# Altium project modbus_rs485_demo.PrjPcb
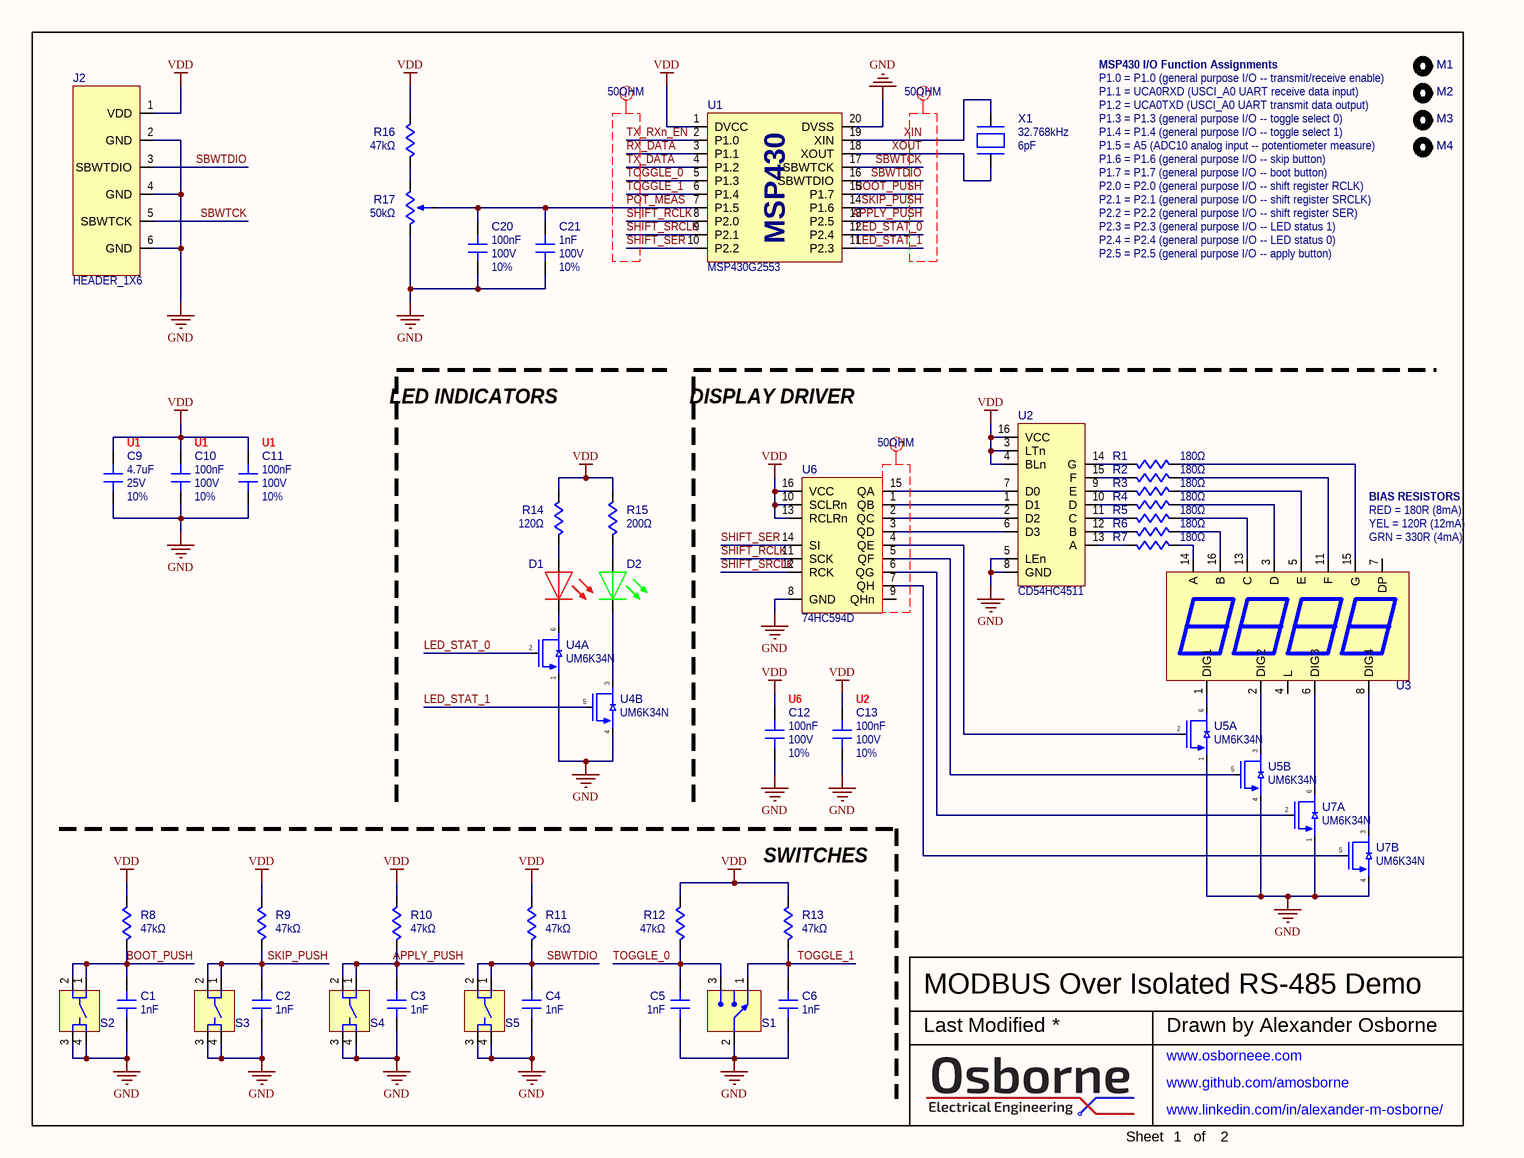
[diagram p0: schematic.SchDoc]
2 sheets, 74 parts. Net scope: global (net labels, ports and power ports of the same name join across sheets).
Board file: pcb.PcbDoc
Sheets:
  schematic.SchDoc
  rs485_interface.SchDoc

## Sheet schematic.SchDoc: MODBUS Over Isolated RS-485 Demo
size Letter; Organization: ORGANIZATION; Address1: ADDRESS 1; Address2: ADDRESS 2; Address3: ADDRESS 3; Address4: ADDRESS 4; DocumentNumber: 1; Revision: -; SheetNumber: 1; SheetTotal: 2; ENG_APP_DATE: --/--/--; DSN_APP_DATE: --/--/--; CHK_APP_DATE: --/--/--

### Parts
C1  value 1nF  [C0805]  (hidden comment: CAP-CER-1N00-10T-100V-0805)
C2  value 1nF  [C0805]  (hidden comment: CAP-CER-1N00-10T-100V-0805)
C3  value 1nF  [C0805]  (hidden comment: CAP-CER-1N00-10T-100V-0805)
C4  value 1nF  [C0805]  (hidden comment: CAP-CER-1N00-10T-100V-0805)
C5  value 1nF  [C0805]  (hidden comment: CAP-CER-1N00-10T-100V-0805)
C6  value 1nF  [C0805]  (hidden comment: CAP-CER-1N00-10T-100V-0805)
C9  value 4.7uF  Voltage: 25V  Tolerance: 10%  [C0805]  (hidden comment: CAP-CER-4U70-10T-25V-0805)
C10  value 100nF  Voltage: 100V  Tolerance: 10%  [C0805]  (hidden comment: CAP-CER-100N-10T-100V-0805)
C11  value 100nF  Voltage: 100V  Tolerance: 10%  [C0805]  (hidden comment: CAP-CER-100N-10T-100V-0805)
C12  value 100nF  Voltage: 100V  Tolerance: 10%  [C0805]  (hidden comment: CAP-CER-100N-10T-100V-0805)
C13  value 100nF  Voltage: 100V  Tolerance: 10%  [C0805]  (hidden comment: CAP-CER-100N-10T-100V-0805)
C20  value 100nF  Voltage: 100V  Tolerance: 10%  [C0805]  (hidden comment: CAP-CER-100N-10T-100V-0805)
C21  value 1nF  Voltage: 100V  Tolerance: 10%  [C0805]  (hidden comment: CAP-CER-1N00-10T-100V-0805)
D1  LED_RED  [D0805]  (value not drawn)
D2  LED_GREEN  [D0805]  (value not drawn)
J2  HEADER_1X6  [Header_1x6]
M1  MTG_HOLE  [MTG_HOLE_No4]  (value not drawn)  (no BOM)
M2  MTG_HOLE  [MTG_HOLE_No4]  (value not drawn)  (no BOM)
M3  MTG_HOLE  [MTG_HOLE_No4]  (value not drawn)  (no BOM)
M4  MTG_HOLE  [MTG_HOLE_No4]  (value not drawn)  (no BOM)
R1  value 180Ω  [R0805]  (hidden comment: RES-180R-1T00-W125-0805)
R2  value 180Ω  [R0805]  (hidden comment: RES-180R-1T00-W125-0805)
R3  value 180Ω  [R0805]  (hidden comment: RES-180R-1T00-W125-0805)
R4  value 180Ω  [R0805]  (hidden comment: RES-180R-1T00-W125-0805)
R5  value 180Ω  [R0805]  (hidden comment: RES-180R-1T00-W125-0805)
R6  value 180Ω  [R0805]  (hidden comment: RES-180R-1T00-W125-0805)
R7  value 180Ω  [R0805]  (hidden comment: RES-180R-1T00-W125-0805)
R8  value 47kΩ  [R0805]  (hidden comment: RES-47K0-1T00-W125-0805)
R9  value 47kΩ  [R0805]  (hidden comment: RES-47K0-1T00-W125-0805)
R10  value 47kΩ  [R0805]  (hidden comment: RES-47K0-1T00-W125-0805)
R11  value 47kΩ  [R0805]  (hidden comment: RES-47K0-1T00-W125-0805)
R12  value 47kΩ  [R0805]  (hidden comment: RES-47K0-1T00-W125-0805)
R13  value 47kΩ  [R0805]  (hidden comment: RES-47K0-1T00-W125-0805)
R14  value 120Ω  [R0805]  (hidden comment: RES-120R-1T00-W125-0805)
R15  value 200Ω  [R0805]  (hidden comment: RES-200R-1T00-W125-0805)
R16  value 47kΩ  [R0805]  (hidden comment: RES-47K0-1T00-W125-0805)
R17  value 50kΩ  [3352T_Trimpot]  (hidden comment: RES-50K0-TRIMMER)
S1  SPDT-TOGGLE-SWITCH  [AST13SNCQ]  (value not drawn)
S2  PTS647  [PTS647]  (value not drawn)
S3  PTS647  [PTS647]  (value not drawn)
S4  PTS647  [PTS647]  (value not drawn)
S5  PTS647  [PTS647]  (value not drawn)
U1  MSP430G2553  [MSP430G2553_TSSOP-20]
U2  CD54HC4511  [CD54HC4511_SOIC-16]
U3  QUAD-7SEG-DISP  [LTC-4727]  (value not drawn)
U4  UM6K34N  [UM6K34N_SC-88]  (parts A,B of 2)
U5  UM6K34N  [UM6K34N_SC-88]  (parts A,B of 2)
U6  74HC594D  [74HC594D_SOIC-16]
U7  UM6K34N  [UM6K34N_SC-88]  (parts A,B of 2)
X1  Capacitance: 6pF  Frequency: 32.768kHz  [CRYSTAL_THT_2x6]  (hidden comment: 830014219B)

### Nets
GND: C1.2 C2.2 C3.2 C4.2 C5.2 C6.2 C9.2 C10.2 C11.2 C12.2 C13.2 C20.2 C21.2 J2.2(GND) J2.4(GND) J2.6(GND) R17.3 S1.2 S2.3 S2.4 S3.3 S3.4 S4.3 S4.4 S5.3 S5.4 U1.20(DVSS) U2.5(LEn) U2.8(GND) U4.1(S1) U4.4(S2) U5.1(S1) U5.4(S2) U6.8(GND) U7.1(S1) U7.4(S2)
VDD: C9.1 C10.1 C11.1 C12.1 C13.1 J2.1(VDD) R8.1 R9.1 R10.1 R11.1 R12.1 R13.1 R14.1 R15.1 R16.1 U1.1(DVCC) U2.3(LTn) U2.4(BLn) U2.16(VCC) U6.10(SCLRn) U6.13(RCLRn) U6.16(VCC)
APPLY_PUSH: C3.1 R10.2 S4.1 S4.2 U1.13(P2.5)
BOOT_PUSH: C1.1 R8.2 S2.1 S2.2 U1.15(P1.7)
LED_STAT_0: U1.12(P2.4) U4.2(G1)
LED_STAT_1: U1.11(P2.3) U4.5(G2)
POT_MEAS: C20.1 C21.1 R17.2 U1.7(P1.5)
RX_DATA: U1.3(P1.1)
SBWTCK: J2.5(SBWTCK) U1.17(SBWTCK)
SBWTDIO: C4.1 J2.3(SBWTDIO) R11.2 S5.1 S5.2 U1.16(SBWTDIO)
SHIFT_RCLK: U1.8(P2.0) U6.11(SCK)
SHIFT_SER: U1.10(P2.2) U6.14(SI)
SHIFT_SRCLK: U1.9(P2.1) U6.12(RCK)
SKIP_PUSH: C2.1 R9.2 S3.1 S3.2 U1.14(P1.6)
TOGGLE_0: C5.1 R12.2 S1.3 U1.5(P1.3)
TOGGLE_1: C6.1 R13.2 S1.1 U1.6(P1.4)
TX_DATA: U1.4(P1.2)
TX_RXn_EN: U1.2(P1.0)
XIN: U1.19(XIN) X1.1
XOUT: U1.18(XOUT) X1.2
NetD1_1: D1.1 U4.6(D1)
NetD1_2: D1.2 R14.2
NetD2_1: D2.1 U4.3(D2)
NetD2_2: D2.2 R15.2
NetR1_1: R1.1 U2.14(G)
NetR1_2: R1.2 U3.15(G)
NetR2_1: R2.1 U2.15(F)
NetR2_2: R2.2 U3.11(F)
NetR3_1: R3.1 U2.9(E)
NetR3_2: R3.2 U3.5(E)
NetR4_1: R4.1 U2.10(D)
NetR4_2: R4.2 U3.3(D)
NetR5_1: R5.1 U2.11(C)
NetR5_2: R5.2 U3.13(C)
NetR6_1: R6.1 U2.12(B)
NetR6_2: R6.2 U3.16(B)
NetR7_1: R7.1 U2.13(A)
NetR7_2: R7.2 U3.14(A)
NetR16_2: R16.2 R17.1
NetU2_1: U2.1(D1) U6.1(QB)
NetU2_2: U2.2(D2) U6.2(QC)
NetU2_6: U2.6(D3) U6.3(QD)
NetU2_7: U2.7(D0) U6.15(QA)
NetU3_1: U3.1(DIG1) U5.6(D1)
NetU3_2: U3.2(DIG2) U5.3(D2)
NetU3_6: U3.6(DIG3) U7.6(D1)
NetU3_8: U3.8(DIG4) U7.3(D2)
NetU5_2: U5.2(G1) U6.4(QE)
NetU5_5: U5.5(G2) U6.5(QF)
NetU6_6: U6.6(QG) U7.2(G1)
NetU6_7: U6.7(QH) U7.5(G2)

Not connected (* = marked no-connect by the designer): U3 4(L) 7(DP) 9(NC); U6 9(QHn)

### Layout directives
net class 50OHM: (no net found under the mark), APPLY_PUSH, BOOT_PUSH, LED_STAT_0, LED_STAT_1, POT_MEAS, RX_DATA, SBWTCK, SBWTDIO, SHIFT_RCLK, SHIFT_SER, SHIFT_SRCLK, SKIP_PUSH, TOGGLE_0, TOGGLE_1, TX_DATA, TX_RXn_EN, XIN, XOUT

### Notes on the sheet
- MSP430 I/O Function Assignments
- P1.1 = UCA0RXD (USCI_A0 UART receive data input)
- (near M1) P1.0 = P1.0 (general purpose I/O -- transmit/receive enable)
- P1.2 = UCA0TXD (USCI_A0 UART transmit data output)
- P1.6 = P1.6 (general purpose I/O -- skip button)
- P1.3 = P1.3 (general purpose I/O -- toggle select 0)
- (near M4) P1.5 = A5 (ADC10 analog input -- potentiometer measure)
- P1.4 = P1.4 (general purpose I/O -- toggle select 1)
- P1.7 = P1.7 (general purpose I/O -- boot button)
- P2.3 = P2.3 (general purpose I/O -- LED status 1)
- (near M4) P2.0 = P2.0 (general purpose I/O -- shift register RCLK)
- (near M4) P2.1 = P2.1 (general purpose I/O -- shift register SRCLK)
- P2.2 = P2.2 (general purpose I/O -- shift register SER)
- P2.5 = P2.5 (general purpose I/O -- apply button)
- P2.4 = P2.4 (general purpose I/O -- LED status 0)
- LED INDICATORS
- DISPLAY DRIVER
- (near C9) U1
- (near C10) U1
- (near C11) U1
- BIAS RESISTORS
- RED = 180R (8mA)
- (near U3) YEL = 120R (12mA)
- (near U3) GRN = 330R (4mA)
- (near C12) U6
- (near C13) U2
- (near R13) SWITCHES
- Last Modified
- Drawn by Alexander Osborne
- www.osborneee.com <http://www.osborneee.com>
- www.github.com/amosborne <http://www.github.com/amosborne>
- Sheet
- www.linkedin.com/in/alexander-m-osborne/ <http://www.linkedin.com/in/alexander-m-osborne/>
- of
- (in symbol MSP430G2553) MSP430

### Library data of the parts
C1-C6 C21 = CAP-CER-1N00-10T-100V-0805: CAP, CER, 1nF ±10%, 100V, 0805; Supplier 1: Digi-Key; Supplier Part Number 1: 732-12102-1-ND
  C1-C6: Voltage: 100V; Tolerance: 10%
C9 = CAP-CER-4U70-10T-25V-0805: CAP, CER, 4.7uF ±10%, 25V, 0805; Supplier 1: Digi-Key; Supplier Part Number 1: 1276-2969-1-ND
C10-C13 C20 = CAP-CER-100N-10T-100V-0805: CAP, CER, 100nF ±10%, 100V, 0805; Supplier 1: Digi-Key; Supplier Part Number 1: 732-12244-1-ND
D1 = LED_RED: Red LED Indicator 0805; Supplier 1: Digi-Key; Supplier Part Number 1: 732-4984-1-ND
D2 = LED_GREEN: Green LED Indicator 0805; Supplier 1: Digi-Key; Supplier Part Number 1: 732-4983-1-ND
J2 = HEADER_1X6: Header, 1-Row, 6-Position
M1-M4 = MTG_HOLE: Mounting Hole
R1-R7 = RES-180R-1T00-W125-0805: RES, 180Ω ±1.00%, 125mW, 0805; Tolerance: 1%; Supplier 1: Digi-Key; Supplier Part Number 1: 13-RT0805FRE07180RLCT-ND; Power: 125mW
R8-R13 R16 = RES-47K0-1T00-W125-0805: RES, 47.0kΩ ±1.00%, 125mW, 0805; Tolerance: 1%; Supplier 1: Digi-Key; Supplier Part Number 1: A129769CT-ND; Power: 125mW
R14 = RES-120R-1T00-W125-0805: RES, 120Ω ±1.00%, 125mW, 0805; Tolerance: 1%; Supplier 1: Digi-Key; Supplier Part Number 1: A129738CT-ND; Power: 125mW
R15 = RES-200R-1T00-W125-0805: RES, 200Ω ±1.00%, 125mW, 0805; Tolerance: 1%; Supplier 1: Digi-Key; Supplier Part Number 1: 13-RT0805FRE07200RLCT-ND; Power: 125mW
R17 = RES-50K0-TRIMMER: 50kOhm Thumbwheel Potentiometer; Supplier 1: Digi-Key; Supplier Part Number 1: 3352T-503LF-ND
S1 = SPDT-TOGGLE-SWITCH: SPDT Toggle Switch, On-Off-On, Through Hole; Supplier 1: Digi-Key; Supplier Part Number 1: 2449-AST13SNCQ-ND
S2-S5 = PTS647: PTS647 Series Tactile Switch; Supplier 1: Digi-Key; Supplier Part Number 1: PTS647SN70SMTR2LFSCT-ND
U1 = MSP430G2553: MSP430 16-BIT, 16KB FLASH, 20-TSSOP; Supplier 1: Digi-Key; Supplier Part Number 1: 296-28430-1-ND
U2 = CD54HC4511: BCD Decoder, 7-Segment Display Driver; Supplier 1: Digi-Key; Supplier Part Number 1: 296-CD74HC4511MTCT-ND
U3 = QUAD-7SEG-DISP: Quad 7-Segment Display, Common Cathode; Supplier 1: Digi-Key; Supplier 2: Digi-Key; Supplier Part Number 2: 160-1547-5-ND; Supplier Part Number 1: 160-1551-5-ND
U4 U5 U7 = UM6K34N: NCH+NCH 50V 200mA Small Signal MOSFET; Supplier 1: Digi-Key; Supplier Part Number 1: UM6K34NTCNCT-ND
U6 = 74HC594D: Shift Register, 8-Bit; Supplier 1: Digi-Key; Supplier Part Number 1: 74HC594DCT-ND
X1 = 830014219B: 32.768kHz Tuning Fork Crystal, 6pF; Supplier 1: Digi-Key; Supplier Part Number 1: 1923-830014219B-ND

## Sheet rs485_interface.SchDoc: MODBUS Over Isolated RS-485 Demo
size Letter; Organization: ORGANIZATION; Address1: ADDRESS 1; Address2: ADDRESS 2; Address3: ADDRESS 3; Address4: ADDRESS 4; Revision: -; SheetNumber: 2; SheetTotal: 2; ENG_APP_DATE: --/--/--; DSN_APP_DATE: --/--/--; CHK_APP_DATE: --/--/--
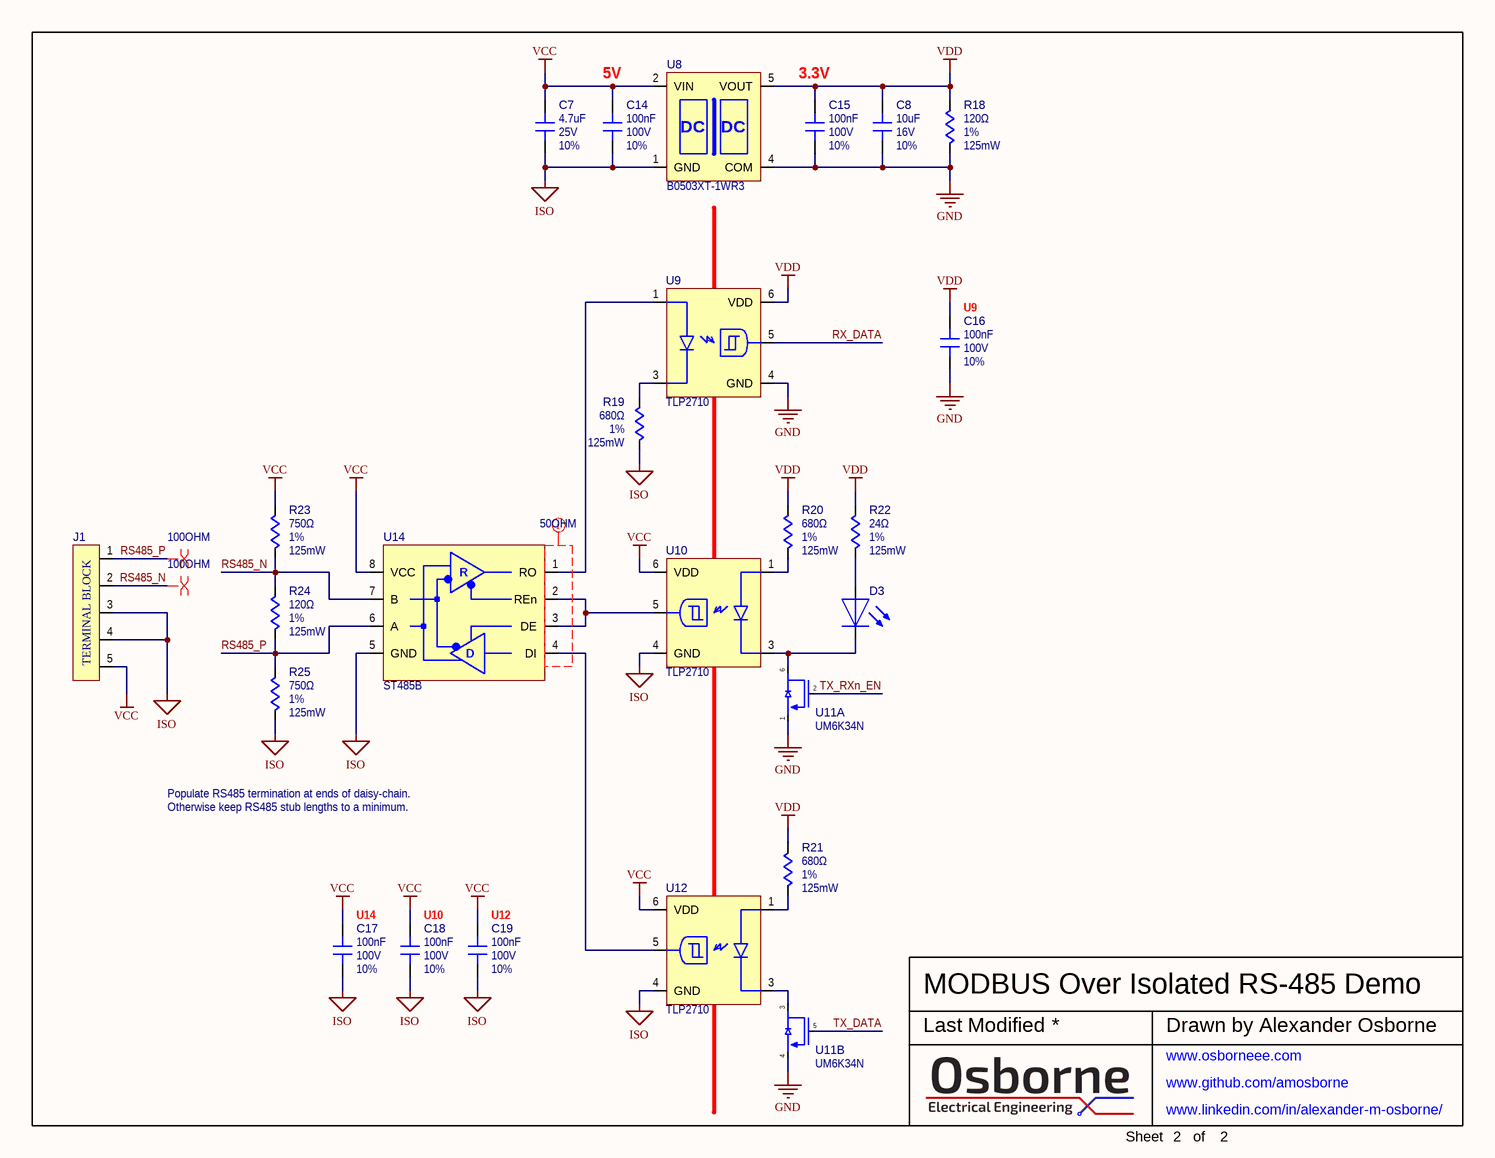
[diagram p1: rs485_interface.SchDoc]

### Parts
C7  value 4.7uF  Voltage: 25V  Tolerance: 10%  [C0805]  (hidden comment: CAP-CER-4U70-10T-25V-0805)
C8  value 10uF  Voltage: 16V  Tolerance: 10%  [C0805]  (hidden comment: CAP-CER-10U0-10T-16V-0805)
C14  value 100nF  Voltage: 100V  Tolerance: 10%  [C0805]  (hidden comment: CAP-CER-100N-10T-100V-0805)
C15  value 100nF  Voltage: 100V  Tolerance: 10%  [C0805]  (hidden comment: CAP-CER-100N-10T-100V-0805)
C16  value 100nF  Voltage: 100V  Tolerance: 10%  [C0805]  (hidden comment: CAP-CER-100N-10T-100V-0805)
C17  value 100nF  Voltage: 100V  Tolerance: 10%  [C0805]  (hidden comment: CAP-CER-100N-10T-100V-0805)
C18  value 100nF  Voltage: 100V  Tolerance: 10%  [C0805]  (hidden comment: CAP-CER-100N-10T-100V-0805)
C19  value 100nF  Voltage: 100V  Tolerance: 10%  [C0805]  (hidden comment: CAP-CER-100N-10T-100V-0805)
D3  LED_BLUE  [D0805]  (value not drawn)
J1  TBLOCK_5POS  [TBLOCK_5POS]  (value not drawn)
R18  value 120Ω  Tolerance: 1%  Power: 125mW  [R0805]  (hidden comment: RES-120R-1T00-W125-0805)
R19  value 680Ω  Tolerance: 1%  Power: 125mW  [R0805]  (hidden comment: RES-680R-1T00-W125-0805)
R20  value 680Ω  Tolerance: 1%  Power: 125mW  [R0805]  (hidden comment: RES-680R-1T00-W125-0805)
R21  value 680Ω  Tolerance: 1%  Power: 125mW  [R0805]  (hidden comment: RES-680R-1T00-W125-0805)
R22  value 24Ω  Tolerance: 1%  Power: 125mW  [R0805]  (hidden comment: RES-24R0-1T00-W125-0805)
R23  value 750Ω  Tolerance: 1%  Power: 125mW  [R0805]  (hidden comment: RES-750R-1T00-W125-0805)
R24  value 120Ω  Tolerance: 1%  Power: 125mW  [R0805]  (hidden comment: RES-120R-1T00-W125-0805)
R25  value 750Ω  Tolerance: 1%  Power: 125mW  [R0805]  (hidden comment: RES-750R-1T00-W125-0805)
U8  B0503XT-1WR3  [B05_XT-1WR3]
U9  TLP2710  [TLP2710_SO-6L]
U10  TLP2710  [TLP2710_SO-6L]
U11  UM6K34N  [UM6K34N_SC-88]  (parts A,B of 2)
U12  TLP2710  [TLP2710_SO-6L]
U14  ST485B  [ST485B_SO-8]

### Nets
GND: C8.2 C15.2 C16.2 R18.2 U8.4(COM) U9.4(GND) U11.1(S1) U11.4(S2)
ISO: C7.2 C14.2 C17.2 C18.2 C19.2 J1.3 J1.4 R19.2 R25.2 U8.1(GND) U10.4(GND) U12.4(GND) U14.5(GND)
VCC: C7.1 C14.1 C17.1 C18.1 C19.1 J1.5 R23.1 U8.2(VIN) U10.6(VDD) U12.6(VDD) U14.8(VCC)
VDD: C8.1 C15.1 C16.1 R18.1 R20.1 R21.1 R22.1 U8.5(VOUT) U9.6(VDD)
RS485_N: J1.2 R23.2 R24.1 U14.7(B)
RS485_P: J1.1 R24.2 R25.1 U14.6(A)
RX_DATA: U9.5(VO)
TX_DATA: U11.5(G2)
TX_RXn_EN: U11.2(G1)
NetD3_1: D3.1 U10.3(CATHODE) U11.6(D1)
NetD3_2: D3.2 R22.2
NetR19_1: R19.1 U9.3(CATHODE)
NetR20_2: R20.2 U10.1(ANODE)
NetR21_2: R21.2 U12.1(ANODE)
NetU9_1: U9.1(ANODE) U14.1(RO)
NetU10_5: U10.5(VO) U14.2(REn) U14.3(DE)
NetU11_3: U11.3(D2) U12.3(CATHODE)
NetU12_5: U12.5(VO) U14.4(DI)

Not connected (* = marked no-connect by the designer): U8 8(NC); U9 2(NC); U10 2(NC); U12 2(NC)

### Layout directives
differential pair; differential pair class 100OHM: RS485_N, RS485_P
net class 50OHM: (no net found under the mark)

### Notes on the sheet
- 5V
- 3.3V
- (near C16) U9
- Populate RS485 termination at ends of daisy-chain.
- Otherwise keep RS485 stub lengths to a minimum.
- (near C17) U14
- (near C18) U10
- (near C19) U12
- Last Modified
- Drawn by Alexander Osborne
- www.osborneee.com <http://www.osborneee.com>
- www.github.com/amosborne <http://www.github.com/amosborne>
- Sheet
- www.linkedin.com/in/alexander-m-osborne/ <http://www.linkedin.com/in/alexander-m-osborne/>
- of
- (in symbol B0503XT-1WR3) DC
- (in symbol ST485B) R; D
- (in symbol TBLOCK_5POS) TERMINAL BLOCK

### Library data of the parts
C7 = CAP-CER-4U70-10T-25V-0805: CAP, CER, 4.7uF ±10%, 25V, 0805; Supplier 1: Digi-Key; Supplier Part Number 1: 1276-2969-1-ND
C8 = CAP-CER-10U0-10T-16V-0805: CAP, CER, 10uF ±10%, 16V, 0805; Supplier 1: Digi-Key; Supplier Part Number 1: 1276-2872-1-ND
C14-C19 = CAP-CER-100N-10T-100V-0805: CAP, CER, 100nF ±10%, 100V, 0805; Supplier 1: Digi-Key; Supplier Part Number 1: 732-12244-1-ND
D3 = LED_BLUE: Blue LED Indicator 0805; Supplier 1: Digi-Key; Supplier Part Number 1: 732-4982-1-ND
J1 = TBLOCK_5POS: Screw Terminal Block, 5-Position
R18 R24 = RES-120R-1T00-W125-0805: RES, 120Ω ±1.00%, 125mW, 0805; Supplier 1: Digi-Key; Supplier Part Number 1: A129738CT-ND
R19-R21 = RES-680R-1T00-W125-0805: RES, 680Ω ±1.00%, 125mW, 0805; Supplier 1: Digi-Key; Supplier Part Number 1: RMCF0805FT680RCT-ND
R22 = RES-24R0-1T00-W125-0805: RES, 24Ω ±1.00%, 125mW, 0805; Supplier 1: Digi-Key; Supplier Part Number 1: 541-24.0CCT-ND
R23 R25 = RES-750R-1T00-W125-0805: RES, 750Ω ±1.00%, 125mW, 0805; Supplier 1: Digi-Key; Supplier Part Number 1: 13-RT0805FRE07750RLCT-ND
U8 = B0503XT-1WR3: Isolated DC/DC, 5Vin, 3.3Vout, 300mA; Supplier 1: Digi-Key; Supplier Part Number 1: 2725-B0503XT-1WR3-ND
U9 U10 U12 = TLP2710: Logic Output Optoisolator 5MBd; Supplier 1: Digi-Key; Supplier Part Number 1: TLP2710(TP4ECT-ND
U11 = UM6K34N: NCH+NCH 50V 200mA Small Signal MOSFET; Supplier 1: Digi-Key; Supplier Part Number 1: UM6K34NTCNCT-ND
U14 = ST485B: 1/1 RS485 Transceiver, Half-Duplex; Supplier 1: Digi-Key; Supplier Part Number 1: 497-3733-1-ND

## Nets that join several sheets
GND: schematic (36 pins), rs485_interface (8 pins)
VDD: schematic (22 pins), rs485_interface (9 pins)
RX_DATA: schematic (U1.3), rs485_interface (U9.5)
TX_DATA: schematic (U1.4), rs485_interface (U11.5)
TX_RXn_EN: schematic (U1.2), rs485_interface (U11.2)